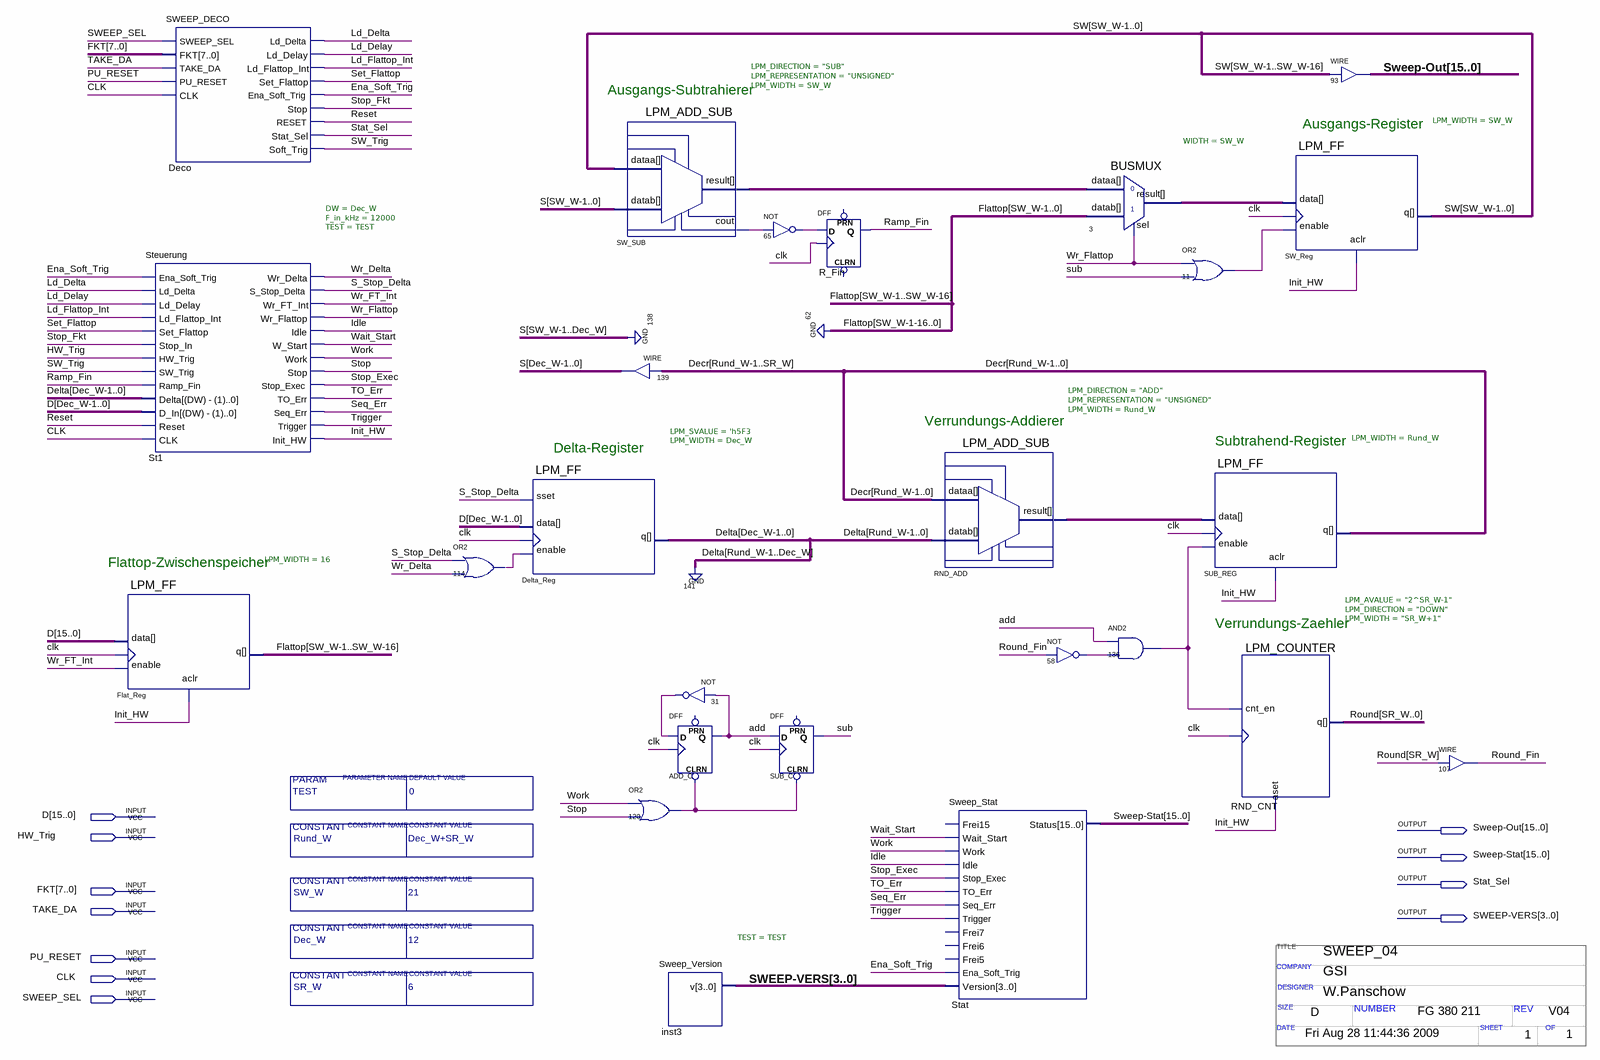
[diagram p0: schematic sheet]
// Quartus schematic sweep_04.bdf as structural Verilog: 25 symbols, 11 pins
// Title block: TITLE: SWEEP_04; COMPANY: GSI; DESIGNER: W.Panschow; SIZE: D; NUMBER: FG 380 211; REV: V04; DATE: Fri Aug 28 11:44:36 2009; SHEET: 1; OF: 1
module sweep_04 #(parameter SR_W = 6, parameter Rund_W = "Dec_W+SR_W", parameter Dec_W = 12, parameter SW_W = 21, parameter TEST = 0) (
  input  [15:0] D,
  input  HW_Trig,
  input  [7:0] FKT,
  input  TAKE_DA,
  input  PU_RESET,
  input  CLK,
  input  SWEEP_SEL,
  output [15:0] \Sweep-Out ,
  output [15:0] \Sweep-Stat ,
  output Stat_Sel,
  output [3:0] \SWEEP-VERS 
);

  wire add, Ena_Soft_Trig, Idle, Init_HW, Ld_Delay, Ld_Delta, Ld_Flattop_Int, n11_out, n31_out, n58_out,
       n65_out, n114_out, n120_out, n136_out, Ramp_Fin, Reset, Round_Fin, S_Stop_Delta, Seq_Err, Set_Flattop,
       Stop, Stop_Exec, Stop_Fkt, sub, SW_SUB_cout, SW_Trig, TO_Err, Trigger, Wait_Start, Work, Wr_Delta,
       Wr_Flattop, Wr_FT_Int;
  wire [6:0] Round;
  wire [11:0] Delta, S;
  wire [17:0] Decr, RND_ADD_result;
  wire [20:0] n3_result, SW, SW_SUB_result;
  wire [20:5] Flattop;

  LPM_FF #(.LPM_WIDTH(16)) Flat_Reg (.enable(Wr_FT_Int), .clock(CLK), .aclr(Init_HW), .data(D), .q(Flattop));
  SWEEP_DECO Deco (
    .SWEEP_SEL(SWEEP_SEL), .FKT(FKT), .TAKE_DA(TAKE_DA), .PU_RESET(PU_RESET), .CLK(CLK), .Ld_Delta(Ld_Delta),
    .Ld_Delay(Ld_Delay), .Ld_Flattop_Int(Ld_Flattop_Int), .Set_Flattop(Set_Flattop),
    .Ena_Soft_Trig(Ena_Soft_Trig), .Stop(Stop_Fkt), .RESET(Reset), .Stat_Sel(Stat_Sel), .Soft_Trig(SW_Trig));
  Steuerung #(.DW(Dec_W), .F_in_kHz(12000), .TEST(TEST)) St1 (
    .Ena_Soft_Trig(Ena_Soft_Trig), .Ld_Delta(Ld_Delta), .Ld_Delay(Ld_Delay), .Ld_Flattop_Int(Ld_Flattop_Int),
    .Set_Flattop(Set_Flattop), .Stop_In(Stop_Fkt), .HW_Trig(HW_Trig), .SW_Trig(SW_Trig), .Ramp_Fin(Ramp_Fin),
    .Delta(Delta), .D_In(D[11:0]), .Reset(Reset), .CLK(CLK), .Wr_Delta(Wr_Delta),
    .S_Stop_Delta(S_Stop_Delta), .Wr_FT_Int(Wr_FT_Int), .Wr_Flattop(Wr_Flattop), .Idle(Idle),
    .W_Start(Wait_Start), .Work(Work), .Stop(Stop), .Stop_Exec(Stop_Exec), .TO_Err(TO_Err),
    .Seq_Err(Seq_Err), .Trigger(Trigger), .Init_HW(Init_HW));
  or u_114 (n114_out, S_Stop_Delta, Wr_Delta);
  LPM_FF #(.LPM_SVALUE('h5F3), .LPM_WIDTH(Dec_W)) Delta_Reg (
    .enable(n114_out), .clock(CLK), .sset(S_Stop_Delta), .data(D[11:0]), .q(Delta));
  LPM_ADD_SUB #(.LPM_DIRECTION("SUB"), .LPM_REPRESENTATION("UNSIGNED"), .LPM_WIDTH(SW_W)) SW_SUB (
    .datab({{9{1'b0}}, S}), .dataa(SW), .cout(SW_SUB_cout), .result(SW_SUB_result));
  assign S = Decr[17:6];  // WIRE 139
  not u_31 (n31_out, add);
  DFF ADD_C (.CLRN(n120_out), .CLK(CLK), .D(n31_out), .Q(add));  // open: PRN
  or u_120 (n120_out, Work, Stop);
  Sweep_Version #(.TEST(TEST)) inst3 (.v(\SWEEP-VERS ));
  not u_65 (n65_out, SW_SUB_cout);
  DFF SUB_C (.CLRN(n120_out), .CLK(CLK), .D(add), .Q(sub));  // open: PRN
  DFF R_Fin (.CLK(CLK), .D(n65_out), .Q(Ramp_Fin));  // open: CLRN, PRN
  LPM_ADD_SUB #(.LPM_DIRECTION("ADD"), .LPM_REPRESENTATION("UNSIGNED"), .LPM_WIDTH(Rund_W)) RND_ADD (
    .datab({{6{1'b0}}, Delta}), .dataa(Decr), .result(RND_ADD_result));
  Sweep_Stat Stat (
    .Wait_Start(Wait_Start), .Work(Work), .Idle(Idle), .Stop_Exec(Stop_Exec), .TO_Err(TO_Err),
    .Seq_Err(Seq_Err), .Trigger(Trigger), .Ena_Soft_Trig(Ena_Soft_Trig), .Version(\SWEEP-VERS ),
    .Status(\Sweep-Stat ));  // open: Frei15, Frei7, Frei6, Frei5
  not u_58 (n58_out, Round_Fin);
  BUSMUX #(.WIDTH(SW_W)) u_3 (
    .datab({Flattop, {5{1'b0}}}), .sel(Wr_Flattop), .dataa(SW_SUB_result), .result(n3_result));
  and u_136 (n136_out, add, n58_out);
  or u_11 (n11_out, Wr_Flattop, sub);
  LPM_FF #(.LPM_WIDTH(Rund_W)) SUB_REG (
    .enable(n136_out), .clock(CLK), .aclr(Init_HW), .data(RND_ADD_result), .q(Decr));
  LPM_COUNTER #(.LPM_AVALUE("2^SR_W-1"), .LPM_DIRECTION("DOWN"), .LPM_WIDTH("SR_W+1")) RND_CNT (
    .cnt_en(n136_out), .clock(CLK), .aset(Init_HW), .q(Round));
  LPM_FF #(.LPM_WIDTH(SW_W)) SW_Reg (.enable(n11_out), .clock(CLK), .aclr(Init_HW), .data(n3_result), .q(SW));
  assign \Sweep-Out  = SW[20:5];  // WIRE 93
  assign Round_Fin = Round[6];  // WIRE 107

  // Notes on the sheet:
  //   Ausgangs-Subtrahierer
  //   Ausgangs-Register
  //   Verrundungs-Addierer
  //   Subtrahend-Register
  //   Delta-Register
  //   Flattop-Zwischenspeicher
  //   Verrundungs-Zaehler
endmodule
